# EAGLE design NEJE-KZ-board (EAGLE 9.6.2)
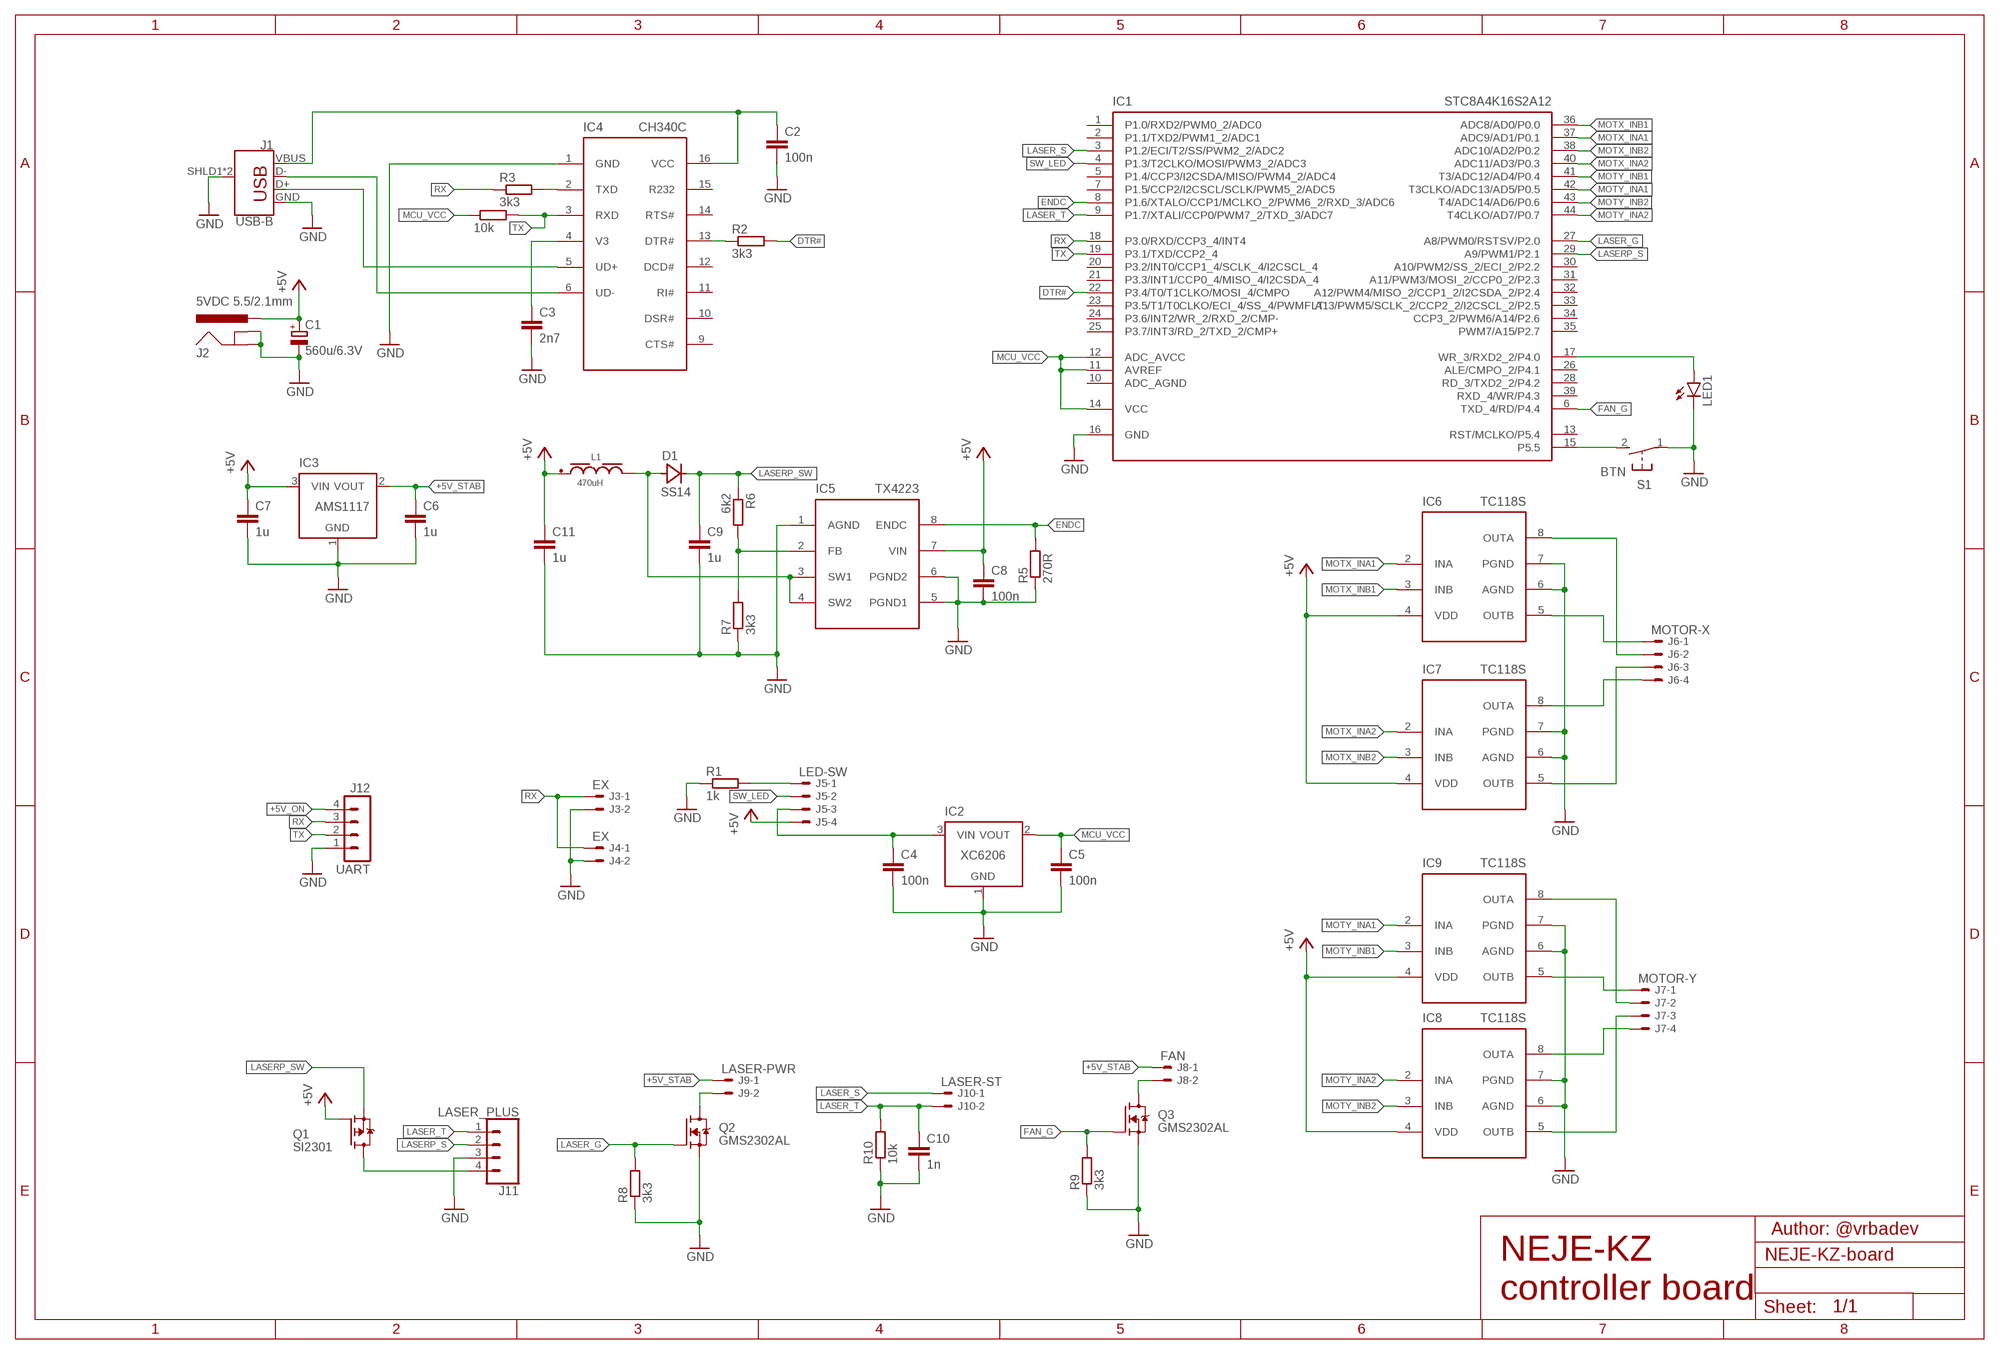
[diagram p0: schematic, sheet 1]

## Parts
C1  560u/6.3V  CPOL-EUE2.5-7  [E2,5-7]
C2  100n  C-EUC0402  [C0402]
C3  2n7  C-EUC0402  [C0402]
C4  100n  C-EUC0402  [C0402]
C5  100n  C-EUC0402  [C0402]
C6  1u  C-EUC0603  [C0603]
C7  1u  C-EUC0603  [C0603]
C8  100n  C-EUC0402  [C0402]
C9  1u  C-EUC0805  [C0805]
C10  1n  C-EUC0402  [C0402]
C11  1u  C-EUC0805  [C0805]
D1  SS14  MBRA340T3  [SMA]
IC1  STC8A4K16S2A12  [LQFP44-10X10]
IC2  XC6206  [SOT23-3]
IC3  AMS1117  [SOT223]
IC4  CH340C  [SO16]
IC5  TX4223  [SOIC8]
IC6  TC118S  [SOIC8]
IC7  TC118S  [SOIC8]
IC8  TC118S  [SOIC8]
IC9  TC118S  [SOIC8]
J1  USB-B  USB_B_PTH  [USB-B-PTH]
J2  5VDC 5.5/2.1mm  POWER_JACKSLT  [POWER_JACK_SLOT]
J3  EX  JST-XH-02-PIN-LONG-PAD  [JST-XH-02-PACKAGE-LONG-PAD]
J4  EX  JST-XH-02-PIN-LONG-PAD  [JST-XH-02-PACKAGE-LONG-PAD]
J5  LED-SW  JST-XH-04-PIN-LONG-PAD  [JST-XH-04-PACKAGE-LONG-PAD]
J6  MOTOR-X  JST-XH-04-PIN-LONG-PAD  [JST-XH-04-PACKAGE-LONG-PAD]
J7  MOTOR-Y  JST-XH-04-PIN-LONG-PAD  [JST-XH-04-PACKAGE-LONG-PAD]
J8  FAN  JST-XH-02-PIN-LONG-PAD  [JST-XH-02-PACKAGE-LONG-PAD]
J9  LASER-PWR  JST-XH-02-PIN-LONG-PAD  [JST-XH-02-PACKAGE-LONG-PAD]
J10  LASER-ST  JST-XH-02-PIN-LONG-PAD  [JST-XH-02-PACKAGE-LONG-PAD]
J11  LASER_PLUS  CONN_04SMD2  [1X04_1MM_RA]
J12  UART  MA04-1  [MA04-1]
L1  470uH  WE-PD_7345_74477724  [WE-PD_7345]
LED1  LEDCHIP-LED0805  [CHIP-LED0805]
Q1  SI2301  [SOT23-3]
Q2  GMS2302AL  [SOT23-3]
Q3  GMS2302AL  [SOT23-3]
R1  1k  R-EU_R0402  [R0402]
R2  3k3  R-EU_R0402  [R0402]
R3  3k3  R-EU_R0402  [R0402]
R4  10k  R-EU_R0402  [R0402]
R5  270R  R-EU_R0402  [R0402]
R6  6k2  R-EU_R0402  [R0402]
R7  3k3  R-EU_R0402  [R0402]
R8  3k3  R-EU_R0402  [R0402]
R9  3k3  R-EU_R0402  [R0402]
R10  10k  R-EU_R0402  [R0402]
S1  BTN  DTSM-3  [DTSM-3]

## Nets
+5V: C1.+ C7.1 C8.1 C11.1 IC3.3(VIN) IC5.7(VIN) IC6.4(VDD) IC7.4(VDD) IC8.4(VDD) IC9.4(VDD) J2.PWR J5.4 L1.1 Q1.1(G)
+5V_ON: C4.1 IC2.3(VIN) J5.3 J12.4
+5V_STAB: C6.1 IC3.2(VOUT) J8.1 J9.1
+5VUSB: C2.1 IC4.16(VCC) J1.VBUS
BTN: IC1.15(P5.5) S1.2
DTR#: IC1.22(P3.4/T0/T1CLKO/MOSI_4/CMPO) R2.2
ENDC: IC1.8(P1.6/XTALO/CCP1/MCLKO_2/PWM6_2/RXD_3/ADC6) IC5.8(ENDC) R5.2
FAN_G: IC1.6(TXD_4/RD/P4.4) Q3.1(G) R9.2
GND: C1.- C2.2 C3.2 C4.2 C5.2 C6.2 C7.2 C8.2 C9.2 C10.2 C11.2 IC1.16(GND) IC2.1(GND) IC3.1(GND) IC4.1(GND) IC5.1(AGND) IC5.5(PGND1) IC5.6(PGND2) IC6.6(AGND) IC6.7(PGND) IC7.6(AGND) IC7.7(PGND) IC8.6(AGND) IC8.7(PGND) IC9.6(AGND) IC9.7(PGND) J1.GND J1.SHLD1(SHIELD) J1.SHLD2(SHIELD) J2.GND@1(GNDBREAK) J2.GND@2(GND) J3.2 J4.2 J11.3 J12.1 LED1.C Q2.2(S) Q3.2(S) R1.1 R5.1 R7.1 R8.1 R9.1 R10.1 S1.1
LASER_G: IC1.27(A8/PWM0/RSTSV/P2.0) Q2.1(G) R8.2
LASER_S: IC1.3(P1.2/ECI/T2/SS/PWM2_2/ADC2) J10.1
LASER_T: C10.1 IC1.9(P1.7/XTALI/CCP0/PWM7_2/TXD_3/ADC7) J10.2 J11.1 R10.2
LASERP_S: IC1.29(A9/PWM1/P2.1) J11.2
LASERP_SW: C9.1 D1.C Q1.2(S) R6.1
LED1: IC1.17(WR_3/RXD2_2/P4.0) LED1.A
MCU_VCC: C5.1 IC1.11(AVREF) IC1.12(ADC_AVCC) IC1.14(VCC) IC2.2(VOUT) R4.1
MOTX_INA1: IC1.37(ADC9/AD1/P0.1) IC6.2(INA)
MOTX_INA2: IC1.40(ADC11/AD3/P0.3) IC7.2(INA)
MOTX_INB1: IC1.36(ADC8/AD0/P0.0) IC6.3(INB)
MOTX_INB2: IC1.38(ADC10/AD2/P0.2) IC7.3(INB)
MOTY_INA1: IC1.42(T3CLKO/ADC13/AD5/P0.5) IC9.2(INA)
MOTY_INA2: IC1.44(T4CLKO/AD7/P0.7) IC8.2(INA)
MOTY_INB1: IC1.41(T3/ADC12/AD4/P0.4) IC9.3(INB)
MOTY_INB2: IC1.43(T4/ADC14/AD6/P0.6) IC8.3(INB)
N$1: C3.1 IC4.4(V3)
N$2: IC4.13(DTR#) R2.1
N$3: IC4.2(TXD) R3.2
N$5: J5.1 R1.2
N$7: IC6.5(OUTB) J6.1
N$8: IC6.8(OUTA) J6.2
N$9: IC7.5(OUTB) J6.3
N$10: IC7.8(OUTA) J6.4
N$11: IC9.5(OUTB) J7.1
N$12: IC9.8(OUTA) J7.2
N$13: IC8.5(OUTB) J7.3
N$14: IC8.8(OUTA) J7.4
N$15: IC5.2(FB) R6.2 R7.2
N$16: J9.2 Q2.3(D)
N$18: J8.2 Q3.3(D)
N$19: J11.4 Q1.3(D)
N$20: D1.A IC5.3(SW1) IC5.4(SW2) L1.2
RX: IC1.18(P3.0/RXD/CCP3_4/INT4) J3.1 J4.1 J12.3 R3.1
SW_LED: IC1.4(P1.3/T2CLKO/MOSI/PWM3_2/ADC3) J5.2
TX: IC1.19(P3.1/TXD/CCP2_4) IC4.3(RXD) J12.2 R4.2
USB_D+: IC4.5(UD+) J1.D+
USB_D-: IC4.6(UD-) J1.D-
Unconnected: IC1.1(P1.0/RXD2/PWM0_2/ADC0) IC1.2(P1.1/TXD2/PWM1_2/ADC1) IC1.5(P1.4/CCP3/I2CSDA/MISO/PWM4_2/ADC4) IC1.7(P1.5/CCP2/I2CSCL/SCLK/PWM5_2/ADC5) IC1.10(ADC_AGND) IC1.13(RST/MCLKO/P5.4) IC1.20(P3.2/INT0/CCP1_4/SCLK_4/I2CSCL_4) IC1.21(P3.3/INT1/CCP0_4/MISO_4/I2CSDA_4) IC1.23(P3.5/T1/T0CLKO/ECI_4/SS_4/PWMFLT) IC1.24(P3.6/INT2/WR_2/RXD_2/CMP-) IC1.25(P3.7/INT3/RD_2/TXD_2/CMP+) IC1.26(ALE/CMPO_2/P4.1) IC1.28(RD_3/TXD2_2/P4.2) IC1.30(A10/PWM2/SS_2/ECI_2/P2.2) IC1.31(A11/PWM3/MOSI_2/CCP0_2/P2.3) IC1.32(A12/PWM4/MISO_2/CCP1_2/I2CSDA_2/P2.4) IC1.33(A13/PWM5/SCLK_2/CCP2_2/I2CSCL_2/P2.5) IC1.34(CCP3_2/PWM6/A14/P2.6) IC1.35(PWM7/A15/P2.7) IC1.39(RXD_4/WR/P4.3) IC4.9(CTS#) IC4.10(DSR#) IC4.11(RI#) IC4.12(DCD#) IC4.14(RTS#) IC4.15(R232)

## Notes on the sheet
- Author: @vrbadev
- NEJE-KZ
  controller board

## Library data of the parts
C1 = rcl:CPOL-EU: POLARIZED CAPACITOR, European symbol; SPICEPREFIX: C
C2-C11 = rcl:C-EU: CAPACITOR, European symbol; SPICEPREFIX: C
D1 = diode:MBRA340T3: Surface Mount Schottky Power Rectifier Source: http://www.onsemi.com/pub_link/Collateral/MBRA340T3-D.PDF
IC1 = custom-library:STC8A4K16S2A12: STC Micro - STC8F family of Micro-controllers
IC2 = custom-library:XC6206: Torex XC6206 Series The XC6206 series are highly precise, low power consumption, 3 terminal, positive voltage regulators manufactured using CMOS and laser trimming technologies. The series provides large currents with a significantly small dropout voltage. The XC6206 consists of a current limiter circuit, a driver transistor, a precision reference voltage and an error correction circuit. The series is compatible with low ESR ceramic capacitors. The currrent limiter's foldback circuit operates as a short circuit protection as well as the output current limiter for the output pin. Output voltages are internally by laser trimming technologies. It is selectable in 0.1V increments within a range of 1.2V to 5.0V. Marking: 662K
IC3 = custom-library:AMS1117: 1A LOW DROPOUT VOLTAGE REGULATOR
IC4 = custom-library:CH340C: CH340 is a USB bus conversion chip, it can realize USB to UART interface or USB to printer interface. In serial UART mode, CH340 provides common MODEM liaison signal, used to expand UART interface of computer or upgrade the common serial device to USB bus directly. For more information on USB conversion to printer interface please refer to the manual CH340DS2.
IC5 = custom-library:TX4223: High efficiency, 5A 1.2MHZ DC-DC boost chip
IC6-IC9 = custom-library:TC118S
J1 = SparkFun-Connectors:USB_B: USB Type B Connector SparkFun Products: SparkFun Stepoko <https://www.sparkfun.com/products/13899> PTH; PROD_ID: CONN-08278; SF_ID: PRT-00139
J2 = kanflo:POWER_JACK: Power Jack This is the standard 5.5mm barrel jack for power. The SLT footprint has been proven in designs produced by DirtyPCBs.com and only works if the mill layer is transmitted to the PCB fab house and the fab house accepts it. Rumours has it OSH Park accepts this design too. This symbol is meant for the cheap PCB mount connectors you find on eBay, retailing at less than 2EUR/10pcs (search for "dc power jack 5.5 2.1 pcb"). The difference between these and the ones sold by eg. SparkFun is the location of the pads relative to the plastic body.
J3 J4 J8-J10 = jst_xh_con:JST-XH-02-PIN: JST XH Connector 2 Pin Wire to board connector. Pitch: 2,54 mm, (0.100") Number of pins: 2 Created by Rembrandt Electronics www.rembrandtelectronics.com
J5-J7 = jst_xh_con:JST-XH-04-PIN: JST XH Connector 2 Pin Wire to board connector. Pitch: 2,54 mm, (0.100") Number of pins: 4 Created by Rembrandt Electronics www.rembrandtelectronics.com
J11 = SparkFun-Connectors:CONN_04: Multi connection point. Often used as Generic Header-pin footprint for 0.1 inch spaced/style header connections On any of the 0.1 inch spaced packages, you can populate with these: Break Away Headers - Straight <https://www.sparkfun.com/products/116> (PRT-00116) Break Away Male Headers - Right Angle <https://www.sparkfun.com/products/553> (PRT-00553) Female Headers <https://www.sparkfun.com/products/115> (PRT-00115) Break Away Headers - Machine Pin <https://www.sparkfun.com/products/117> (PRT-00117) Break Away Female Headers - Swiss Machine Pin <https://www.sparkfun.com/products/743> (PRT-00743) For SCREWTERMINALS and SPRING TERMINALS visit here: Screw Terimnals on SparkFun.com <https://www.sparkfun.com/search/results?term=Screw+Terminals> (5mm/3.5mm/2.54mm spacing) This device is also useful as a general connection point to wire up your design to another part of your project. Our various solder wires solder well into these plated through hole pads. Hook-Up Wire - Assortment (Stranded, 22 AWG) <https://www.sparkfun.com/products/11375> (PRT-11375) Hook-Up Wire - Assortment (Solid Core, 22 AWG) <https://www.sparkfun.com/products/11367> (PRT-11367) View the entire wire category on our website here <https://www.sparkfun.com/categories/141> Special notes: Molex polarized connector foot print use with SKU : PRT-08231 with associated crimp pins and housings. 1MM SMD Version SKU: PRT-10208; PROD_ID: CONN-10310; SF_ID: PRT-10208
J12 = con-lstb:MA04-1: PIN HEADER; OC_FARNELL: unknown; OC_NEWARK: unknown
L1 = Eagle_WE-PD (rev20a):WE-PD_7345: WE-PD SMT Power Inductor Characteristics AECQ 200 Qualified Ultra low RDC and RAC Highest possible saturation current based on Ferrite Suitable for switching frequency up to 10MHz Temperature dependent parameter available on Redexpert Operating Temperature from -40°C to +125°C / +150°C Types WE-PD: Since always with low loss material, tight tolerances and high saturation behavior compared to other manufacturers in the market WE-PD Robust: Plastic base improves the mechanical stability and efficiency WE-PD Performance: MnZn core improves Saturation and RDC for highest efficiency Applications Switch Mode Power supplies from 0,1W up to 300W Integrated DC DC Converter Ideal for Switch Mode Power supplies with extreme high efficiency (>95%) <https://www.we-online.com/catalog/media/o14825v209%20Family_WE-PD.jpg> Details see: https://www.we-online.com/catalog/en/WE-PD/ Updated by Yingchun,Shan 2019-07-25 2019 (C) Wurth Elektronik; DATASHEET-URL: https://www.we-online.com/catalog/datasheet/74477724.pdf; FRES: 3.2MHz; IR: 0.29A; ISAT: 0.34A; MOUNT: SMT; PART-NUMBER: 74477724; RDC-MAX: 3010mOhm; RDC-TYP: 1600mOhm; VERSION: Standard
LED1 = led:LED: LED OSRAM: - CHIPLED LG R971, LG N971, LY N971, LG Q971, LY Q971, LO R971, LY R971 LH N974, LH R974 LS Q976, LO Q976, LY Q976 LO Q996 - Hyper CHIPLED LW Q18S LB Q993, LB Q99A, LB R99A - SideLED LS A670, LO A670, LY A670, LG A670, LP A670 LB A673, LV A673, LT A673, LW A673 LH A674 LY A675 LS A676, LA A676, LO A676, LY A676, LW A676 LS A679, LY A679, LG A679 - Hyper Micro SIDELED® LS Y876, LA Y876, LO Y876, LY Y876 LT Y87S - SmartLED LW L88C, LW L88S LB L89C, LB L89S, LG L890 LS L89K, LO L89K, LY L89K LS L896, LA L896, LO L896, LY L896 - TOPLED LS T670, LO T670, LY T670, LG T670, LP T670 LSG T670, LSP T670, LSY T670, LOP T670, LYG T670 LG T671, LOG T671, LSG T671 LB T673, LV T673, LT T673, LW T673 LH T674 LS T676, LA T676, LO T676, LY T676, LB T676, LH T676, LSB T676, LW T676 LB T67C, LV T67C, LT T67C, LS T67K, LO T67K, LY T67K, LW E67C LS E67B, LA E67B, LO E67B, LY E67B, LB E67C, LV E67C, LT E67C LW T67C LS T679, LY T679, LG T679 LS T770, LO T770, LY T770, LG T770, LP T770 LB T773, LV T773, LT T773, LW T773 LH T774 LS E675, LA E675, LY E675, LS T675 LS T776, LA T776, LO T776, LY T776, LB T776 LHGB T686 LT T68C, LB T68C - Hyper Mini TOPLED® LB M676 - Mini TOPLED Santana® LG M470 LS M47K, LO M47K, LY M47K Source: http://www.osram.convergy.de LUXEON: - LUMILED® LXK2-PW12-R00, LXK2-PW12-S00, LXK2-PW14-U00, LXK2-PW14-V00 LXK2-PM12-R00, LXK2-PM12-S00, LXK2-PM14-U00 LXK2-PE12-Q00, LXK2-PE12-R00, LXK2-PE12-S00, LXK2-PE14-T00, LXK2-PE14-U00 LXK2-PB12-K00, LXK2-PB12-L00, LXK2-PB12-M00, LXK2-PB14-N00, LXK2-PB14-P00, LXK2-PB14-Q00 LXK2-PR12-L00, LXK2-PR12-M00, LXK2-PR14-Q00, LXK2-PR14-R00 LXK2-PD12-Q00, LXK2-PD12-R00, LXK2-PD12-S00 LXK2-PH12-R00, LXK2-PH12-S00 LXK2-PL12-P00, LXK2-PL12-Q00, LXK2-PL12-R00 Source: www.luxeon.com KINGBRIGHT: KA-3528ASYC Source: www.kingbright.com
Q1 = custom-library:SI2301: P-Channel 20-V(D-S) MOSFET Marking: A1sHB
Q2 Q3 = custom-library:GMS2302AL: N-Channel Enhancement-Mode MOS FETs Marking: A2sHB
R1-R10 = rcl:R-EU_: RESISTOR, European symbol; SPICEPREFIX: R
S1 = switch-tact:DTSM-3

## Board
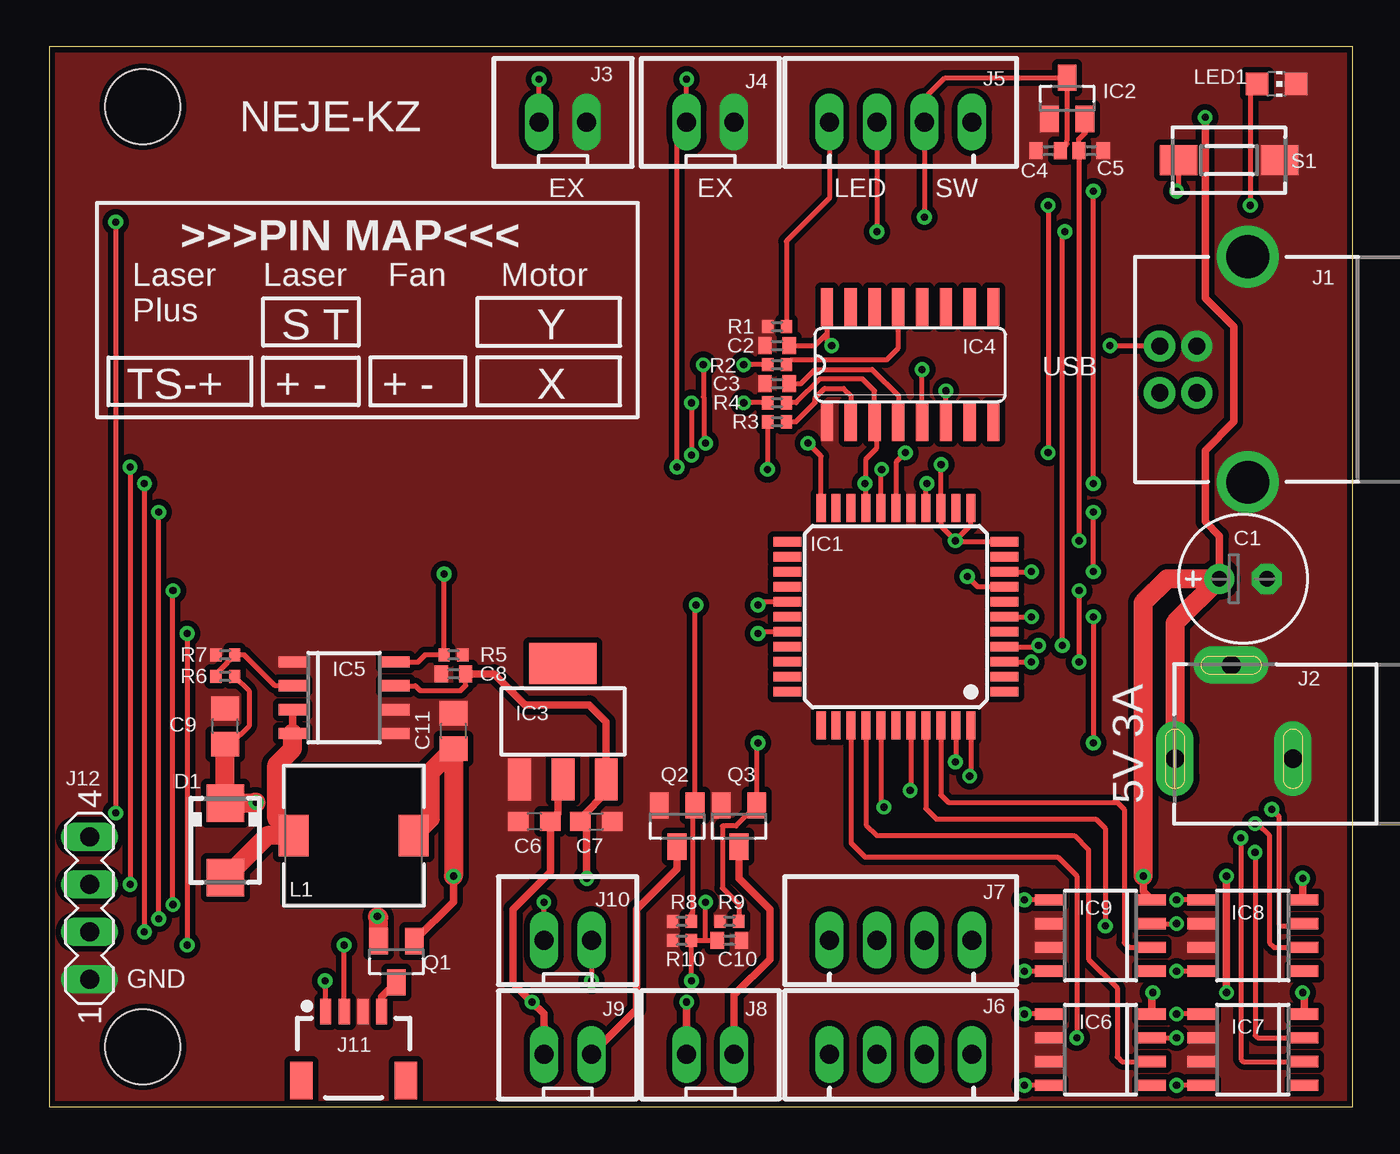
[diagram p1: board, top side]
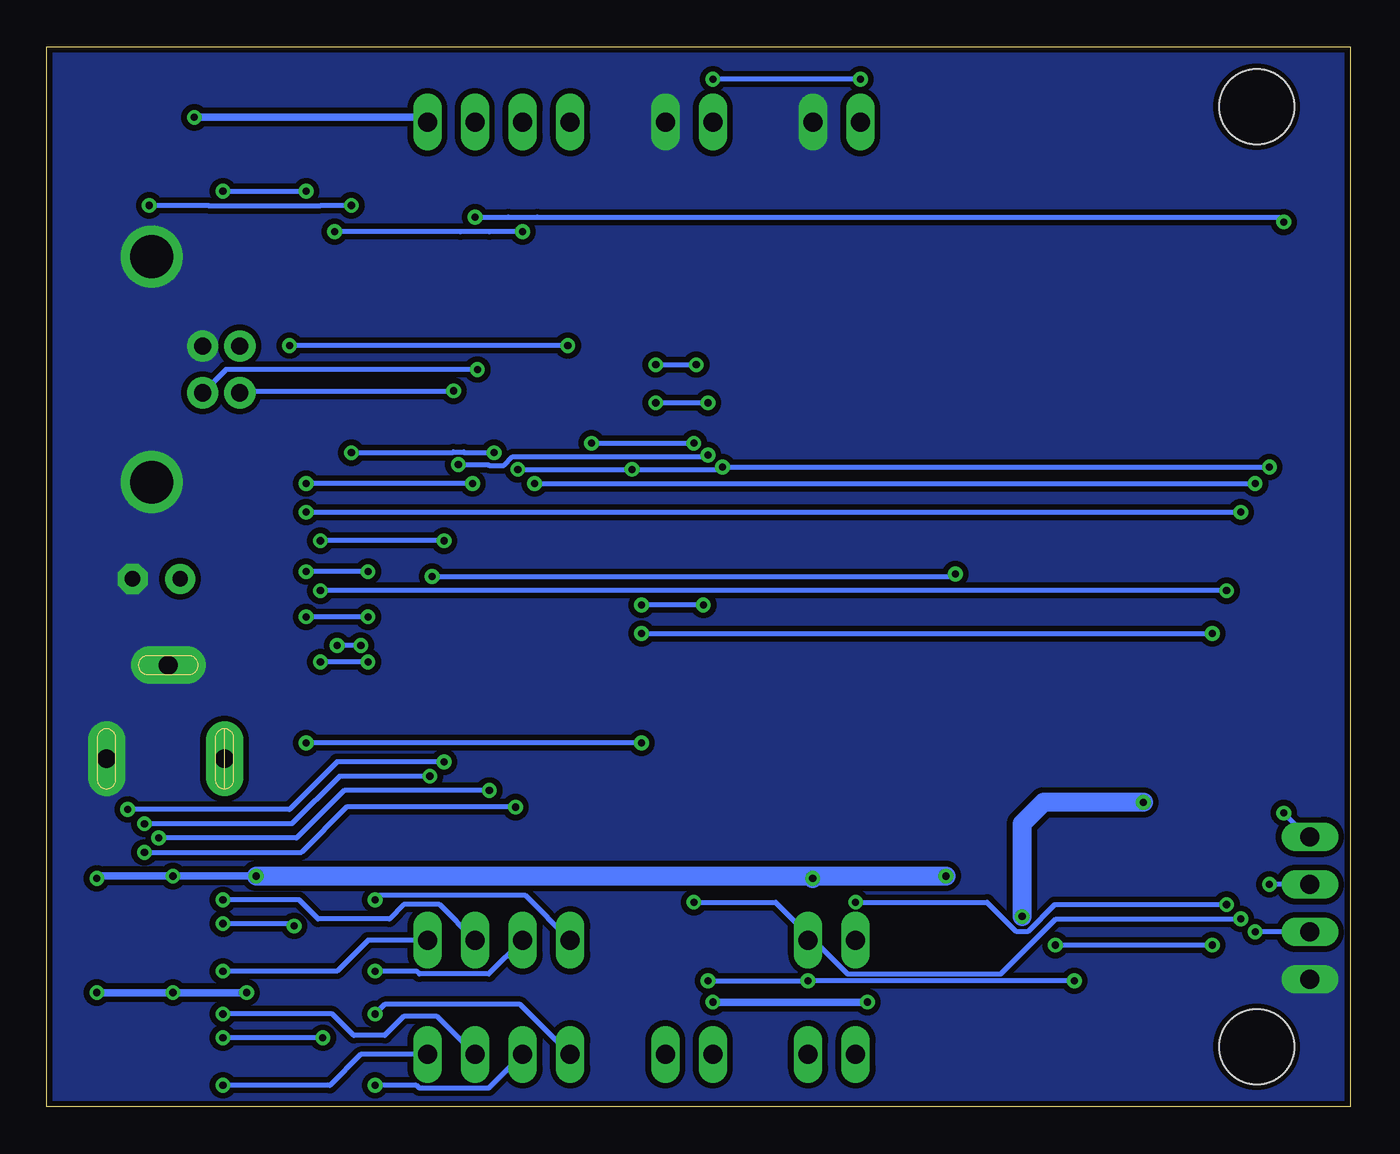
[diagram p2: board, bottom side, seen from below]

Size 69.6 x 56.6 mm. Coordinates in mm from the lower left corner, seen from the top.
Outline: 0,0 69.6,0 69.6,56.6 0,56.6 0,0
Copper layers (1*16): Top 0.035mm / dielectric 1.5mm / Bottom 0.035mm
Design rules "default *": minimum track width 6mil, minimum drill 0.35mm, track to track 6mil, track to pad 6mil, pad to pad 6mil, via to via 6mil, smd to smd 6mil, copper to edge 10mil, drill to drill 6mil, minimum pad ring 10mil, minimum via ring 8mil, stop-mask expansion 4mil, vias tented up to drill 0mil, thermal gap 10mil
Holes 4 mm at 5,3.2 5,53.4

### Footprints (pad centres in the part's own frame; a part is rotated, then mirrored left to right if it is on the bottom)
E2,5-7 = drill 0.813 pad 1.6: + -1.27,0 | drill 0.813 pad 1.6 octagon: - 1.27,0
C0402 = smd 0.7 x 0.9: 1 -0.65,0; 2 0.65,0
C0603 = smd 1.1 x 1: 1 -0.85,0; 2 0.85,0
C0805 = smd 1.3 x 1.5: 1 -0.95,0; 2 0.95,0
SMA = smd 2 x 2: A 2,0; C -2,0
LQFP44-10X10 = smd 1.5 x 0.5: 1 -5.8,4; 2 -5.8,3.2; 3 -5.8,2.4; 4 -5.8,1.6; 5 -5.8,0.8; 6 -5.8,0; 7 -5.8,-0.8; 8 -5.8,-1.6; 9 -5.8,-2.4; 10 -5.8,-3.2; 11 -5.8,-4; 23 5.8,-4; 24 5.8,-3.2; 25 5.8,-2.4; 26 5.8,-1.6; 27 5.8,-0.8; 28 5.8,0; 29 5.8,0.8; 30 5.8,1.6; 31 5.8,2.4; 32 5.8,3.2; 33 5.8,4 | smd 0.5 x 1.5: 12 -4,-5.8; 13 -3.2,-5.8; 14 -2.4,-5.8; 15 -1.6,-5.8; 16 -0.8,-5.8; 17 0,-5.8; 18 0.8,-5.8; 19 1.6,-5.8; 20 2.4,-5.8; 21 3.2,-5.8; 22 4,-5.8; 34 4,5.8; 35 3.2,5.8; 36 2.4,5.8; 37 1.6,5.8; 38 0.8,5.8; 39 0,5.8; 40 -0.8,5.8; 41 -1.6,5.8; 42 -2.4,5.8; 43 -3.2,5.8; 44 -4,5.8
SOT23-3 = smd 1 x 1.4: 1 -0.95,-1.1; 2 0.95,-1.1; 3 0,1.1
SOT223 = smd 1.219 x 2.235: 1 -2.311,-3.099; 2 0,-3.099; 3 2.311,-3.099 | smd 3.6 x 2.2: 4 0,3.099
SO16 = smd 0.66 x 2.032: 1 -4.445,-3.073; 2 -3.175,-3.073; 3 -1.905,-3.073; 4 -0.635,-3.073; 5 0.635,-3.073; 6 1.905,-3.073; 7 3.175,-3.073; 8 4.445,-3.073; 9 4.445,3.073; 10 3.175,3.073; 11 1.905,3.073; 12 0.635,3.073; 13 -0.635,3.073; 14 -1.905,3.073; 15 -3.175,3.073; 16 -4.445,3.073
SOIC8 = smd 0.6 x 1.5: 1 -1.905,-2.75; 2 -0.635,-2.75; 3 0.635,-2.75; 4 1.905,-2.75; 5 1.905,2.75; 6 0.635,2.75; 7 -0.635,2.75; 8 -1.905,2.75
USB-B-PTH = drill 0.914 pad 1.676: D+ 4,1.25; D- 5.981,1.25; GND 4,-1.25; VBUS 5.981,-1.25 | drill 2.286: SHLD1 1.282,-6.02; SHLD2 1.282,6.02
POWER_JACK_SLOT = drill 1 pad 2 long: GND@1 2.5,1.39; GND@2 -2.5,-1.91; PWR 2.5,-4.91
JST-XH-02-PACKAGE-LONG-PAD = drill 1.016 long: 1 -1.27,0; 2 1.27,0
JST-XH-04-PACKAGE-LONG-PAD = drill 1.016 long: 1 -3.81,0; 2 -1.27,0; 3 1.27,0; 4 3.81,0
1X04_1MM_RA = smd 0.6 x 1.35: 1 -1.5,0; 2 -0.5,0; 3 0.5,0; 4 1.5,0 | smd 1.2 x 2: NC1 2.8,-3.675; NC2 -2.8,-3.675
MA04-1 = drill 1.016 long: 1 -3.81,0; 2 -1.27,0; 3 1.27,0; 4 3.81,0
WE-PD_7345 = smd 1.6 x 2.2: 1 -3.2,0; 2 3.2,0
CHIP-LED0805 = smd 1.2 x 1.2: A 0,-1.05; C 0,1.05
R0402 = smd 0.6 x 0.7: 1 -0.5,0; 2 0.5,0
DTSM-3 = smd 2 x 1.6: 1 -2.7,0; 2 2.7,0

### Placement (x,y rotation side)
C1  63.75,28.19 0 top
C2  38.86,40.64 180 top
C3  38.86,38.61 180 top
C4  53.34,51.05 180 top
C5  55.63,51.05 0 top
C6  25.91,15.24 180 top
C7  29.21,15.24 0 top
C8  21.59,23.11 180 top
C9  9.4,20.32 90 top
C10  36.32,8.89 0 top
C11  21.59,20.07 90 top
D1  9.4,14.22 270 top
IC1  45.21,26.16 180 top
IC2  54.36,53.85 0 top
IC3  27.43,20.57 0 top
IC4  45.97,39.62 0 top
IC5  15.75,21.84 270 top
IC6  56.13,3.05 90 top
IC7  64.26,3.05 90 top
IC8  64.26,9.14 90 top
IC9  56.13,9.14 90 top
J1  65.28,39.37 180 top
J2  65.02,21.08 270 top
J3  27.43,52.58 0 top
J4  35.31,52.58 0 top
J5  45.47,52.58 0 top
J6  45.47,2.79 0 top
J7  45.47,8.89 0 top
J8  35.31,2.79 0 top
J9  27.69,2.79 0 top
J10  27.69,8.89 0 top
J11  16.26,5.08 0 top
J12  2.16,10.6 90 top
L1  16.26,14.48 180 top
LED1  65.53,54.61 270 top
Q1  18.54,7.75 180 top
Q2  33.53,14.99 180 top
Q3  36.83,14.99 180 top
R1  38.86,41.66 0 top
R2  38.86,39.62 180 top
R3  38.86,36.58 0 top
R4  38.86,37.59 0 top
R5  21.59,24.13 180 top
R6  9.4,22.99 180 top
R7  9.4,24.13 0 top
R8  33.78,9.91 0 top
R9  36.32,9.91 0 top
R10  33.78,8.89 0 top
S1  62.99,50.55 180 top

### Tracks (layer width: path | path; a pad name or v marks a point on that pad's centre or on a via)
+5V  (via drill 0.38)
  Top 0.254: Q1.1 19.28,8.64 | IC5.7 19.56,22.48 19.81,22.23 21.97,22.23 22.24,22.49 C8.1
  Top 0.406: C1.+ 62.48,30.48 61.72,31.24 61.72,35.05 63.25,36.58 63.25,41.66 61.72,43.18 v61.72,52.83 | C8.1 23.75,23.11 25.4,21.46 28.83,21.46 29.74,20.55 IC3.3 29.84,17.37 29.84,16.89 28.36,15.41 C7.1 28.7,14.9 v28.7,12.19 | IC9.4 58.42,11.51 v58.42,12.32 | IC8.4 66.93,11.13 v66.93,12.19 | IC7.4 67.01,6.01 v66.93,6.1 | IC6.4 58.88,6.05 v58.93,6.1 | v62.87,12.32 v62.87,6.1 | Q1.1 21.59,10.95 v21.59,12.32
  Top 1.016: J2.PWR 60.11,25.82 C1.+ 59.69,28.19 58.42,26.92 v58.42,12.32 | v21.59,12.32 C11.1 20.36,17.89 20.36,15.4 L1.1
  Bottom 0.406: v58.42,12.32 v62.87,12.32 66.8,12.32 v66.93,12.19 | v58.93,6.1 v62.87,6.1 v66.93,6.1 | J5.4 49.28,52.83 v61.72,52.83
  Bottom 1.016: v58.42,12.32 28.83,12.32 | v28.7,12.19 28.83,12.32 | 28.83,12.32 v21.59,12.32
+5V_ON  (via drill 0.38)
  Top 0.254: C4.1 54.35,51.41 54.35,51.62 54.36,51.63 IC2.3 47.84,54.95 46.74,53.85 J5.3 v46.74,47.5 | v3.56,47.24 v3.56,15.68
  Bottom 0.254: v46.74,47.5 44.97,47.5 44.97,47.51 43.42,47.51 43.42,47.5 3.81,47.5 v3.56,47.24 | J12.4 2.29,14.41 v3.56,15.68
+5V_STAB  (via drill 0.38)
  Top 0.406: J8.1 v34.04,5.59 | J9.1 26.42,4.95 v25.78,5.59 24.77,6.6 24.77,10.54 26.76,12.53 C6.1 27.18,15.66 27.18,17.22 IC3.2
  Bottom 0.406: v25.78,5.59 v34.04,5.59
+5VUSB  (via drill 0.38)
  Top 0.254: C2.1 40.89,40.64 41.53,41.27 | IC4.16 41.53,41.27 | J1.VBUS 56.66,40.62 v56.64,40.64 | 41.53,41.27 41.53,40.89 v41.78,40.64
  Bottom 0.254: v41.78,40.64 v56.64,40.64
BTN  (via drill 0.38)
  Top 0.254: IC1.15 46.81,33.22 v46.86,33.27 | S1.2 60.29,48.99 v60.2,48.9 | v55.75,33.27 v55.75,48.9
  Bottom 0.254: v60.2,48.9 v55.75,48.9 | v46.86,33.27 v55.75,33.27
DTR#  (via drill 0.38)
  Top 0.254: IC1.22 41.21,34.73 v40.51,35.43 | R2.2 v37.08,39.62 | v34.92,39.62 34.92,37.91 34.96,37.87 34.96,35.52 v35.05,35.43
  Bottom 0.254: v37.08,39.62 v34.92,39.62 | v40.51,35.43 v35.05,35.43
ENDC  (via drill 0.38)
  Top 0.254: IC1.8 49.58,27.76 v49.02,28.32 | IC5.8 19.68,23.75 20.07,24.13 R5.2 v21.09,28.44 v21.08,28.45
  Bottom 0.254: v49.02,28.32 21.21,28.32 v21.08,28.45
FAN_G  (via drill 0.38)
  Top 0.254: IC1.6 v52.45,26.16 | v37.85,19.43 37.78,19.36 Q3.1 36.68,14.99 35.94,14.99 35.94,11.68 36.83,10.79 R9.2 | v55.75,26.16 v55.75,19.43
  Bottom 0.254: v52.45,26.16 v55.75,26.16 | v37.85,19.43 v55.75,19.43
GND
  pour Bottom (isolate 0.305, no thermals): 0,56.6 69.6,56.6 69.6,0 0,0
  pour Top (isolate 0.305, no thermals): 0,56.6 69.6,56.6 69.6,0 0,0
LASER_G  (via drill 0.38)
  Top 0.254: IC1.27 38.01,26.96 v37.85,26.8 | v34.54,26.8 34.48,26.73 Q2.1 34.35,15.96 34.35,10.35 34.28,10.28 R8.2
  Bottom 0.254: v34.54,26.8 v37.85,26.8
LASER_S  (via drill 0.38)
  Top 0.254: IC1.3 52.44,23.76 v52.45,23.75 | J10.1 v26.42,10.92 | v6.6,10.79 v6.6,27.56 | v54.99,27.56 v54.99,23.75
  Bottom 0.254: v26.42,10.92 19.4,10.92 17.85,9.37 17.2,9.37 15.78,10.79 v6.6,10.79 | v6.6,27.56 v54.99,27.56 | v52.45,23.75 v54.99,23.75
LASER_T  (via drill 0.38)
  Top 0.254: IC1.9 52.44,28.56 v52.45,28.57 | 35.05,8.89 R10.2 v34.28,6.74 v34.29,6.73 | 35.05,8.89 C10.1 | 35.05,8.89 v35.05,10.92 | J11.1 14.76,6.33 14.73,6.35 v14.73,6.73 | J10.2 v28.96,6.73 | v5.84,10.03 v5.84,31.75 | v55.75,28.57 v55.75,31.75
  Bottom 0.254: v34.29,6.73 v28.96,6.73 v14.73,6.73 | v35.05,10.92 30.68,10.92 26.85,7.09 18.66,7.09 15.71,10.03 v5.84,10.03 | v52.45,28.57 v55.75,28.57 | v55.75,31.75 v5.84,31.75
LASERP_S  (via drill 0.38)
  Top 0.254: IC1.29 37.94,25.36 v37.85,25.27 | J11.2 15.75,5.09 v15.75,8.64 | v7.37,25.27 v7.37,8.64
  Bottom 0.254: v15.75,8.64 v7.37,8.64 | v37.85,25.27 v7.37,25.27
LASERP_SW  (via drill 0.38)
  Top 0.254: R6.1 10.67,22.22 10.67,20.32 9.72,19.37 C9.1
  Top 1.016: C9.1 D1.C 10.95,16.22 | 10.95,16.22 10.98,16.26 | Q1.2 17.59,10.09 v17.53,10.16 | v11.05,16.26 11.05,16.22 10.95,16.22
  Bottom 1.016: v11.05,16.26 16.38,16.26 17.53,15.11 v17.53,10.16
LED1  (via drill 0.38)
  Top 0.254: v45.72,34.92 45.21,34.42 IC1.17 | LED1.A 64.14,54.26 v64.14,48.13 | v53.34,48.13 v53.34,34.92
  Bottom 0.254: v64.14,48.13 60.97,48.13 60.97,48.12 54.98,48.12 54.98,48.13 v53.34,48.13 | v53.34,34.92 47.94,34.92 47.9,34.96 47.35,34.96 47.31,34.92 v45.72,34.92
MCU_VCC  (via drill 0.38)
  Top 0.254: IC2.2 55.37,52.68 55.37,52.07 54.98,51.67 C5.1 54.98,30.24 v54.99,30.23 54.93,30.16 | v48.39,30.23 47.61,31 IC1.14 47.61,34.28 v47.62,34.29 | v48.39,30.23 49.21,31.05 IC1.12 | IC1.11 48.45,30.16 v48.39,30.23 | R4.1 v37.08,37.59 | v34.29,37.59 v34.29,34.8
  Bottom 0.254: v48.39,30.23 v54.99,30.23 | v37.08,37.59 v34.29,37.59 | v47.62,34.29 46.04,34.29 46,34.25 45.19,34.25 44.73,34.71 34.38,34.71 v34.29,34.8
MOTX_INA1
  Top 0.254: IC1.37 43.61,15.06 44.2,14.48 54.74,14.48 55.5,13.72 55.5,7.87 57.02,6.35 57.02,2.67 57.28,2.41 IC6.2
MOTX_INA2  (via drill 0.38)
  Top 0.254: IC1.40 46.01,16.93 v45.97,16.89 | v63.63,14.35 63.63,2.54 63.75,2.41 IC7.2
  Bottom 0.254: v45.97,16.89 53.72,16.89 56.26,14.35 v63.63,14.35
MOTX_INB1  (via drill 0.38)
  Top 0.254: IC1.36 42.81,14.08 43.56,13.34 53.85,13.34 54.86,12.32 v54.86,3.68 | IC6.3 v60.2,3.68
  Bottom 0.254: v54.86,3.68 v60.2,3.68
MOTX_INB2  (via drill 0.38)
  Top 0.254: IC1.38 44.41,16.17 v44.58,16 | v64.39,13.59 64.39,3.81 64.52,3.68 IC7.3
  Bottom 0.254: v44.58,16 53.59,16 56.01,13.59 v64.39,13.59
MOTY_INA1
  Top 0.254: IC1.42 47.61,16.65 48.01,16.26 57.02,16.26 57.4,15.88 57.4,8.76 57.66,8.51 IC9.2
MOTY_INA2  (via drill 0.38)
  Top 0.254: IC1.44 49.21,17.72 v49.15,17.65 | v64.39,15.11 64.52,15.11 65.15,14.48 65.15,8.76 65.41,8.51 IC8.2
  Bottom 0.254: v49.15,17.65 53.98,17.65 56.52,15.11 v64.39,15.11
MOTY_INB1  (via drill 0.38)
  Top 0.254: IC1.41 46.81,15.93 47.37,15.37 55.88,15.37 56.39,14.86 v56.39,9.65 | IC9.3 v60.2,9.78
  Bottom 0.254: v56.39,9.65 56.52,9.78 v60.2,9.78
MOTY_INB2  (via drill 0.38)
  Top 0.254: IC1.43 48.41,18.44 v48.39,18.41 | v65.28,15.88 65.66,15.49 65.66,9.78 65.79,9.65 66.89,9.65 IC8.3
  Bottom 0.254: v48.39,18.41 54.1,18.41 56.64,15.88 v65.28,15.88
N$1
  Top 0.254: C3.1 40.13,38.61 40.89,39.37 43.94,39.37 45.34,37.97 IC4.4
N$2
  Top 0.254: R2.1 39.62,39.88 44.7,39.88 45.34,40.51 IC4.13
N$3
  Top 0.254: R3.2 39.88,36.58 40.89,37.59 40.89,37.85 41.4,38.35 42.42,38.35 42.8,37.97 IC4.2
N$5
  Top 0.254: J5.1 41.66,48.51 39.36,46.22 R1.2
N$7  (via drill 0.38)
  Top 0.254: IC6.5 v52.07,4.95
  Bottom 0.254: J6.1 44.32,5.46 51.56,5.46 v52.07,4.95
N$8  (via drill 0.38)
  Top 0.254: IC6.8 v52.07,1.14
  Bottom 0.254: v52.07,1.14 49.86,1.14 49.71,0.99 46,0.99 J6.2
N$9  (via drill 0.38)
  Top 0.254: IC7.5 v60.2,4.95
  Bottom 0.254: J6.3 48.77,4.83 50.55,4.83 51.56,3.81 53.21,3.81 54.36,4.95 v60.2,4.95
N$10  (via drill 0.38)
  Top 0.254: IC7.8 v60.2,1.14
  Bottom 0.254: J6.4 52.83,2.79 54.48,1.14 v60.2,1.14
N$11  (via drill 0.38)
  Top 0.254: IC9.5 v52.07,11.05
  Bottom 0.254: v52.07,11.05 51.82,11.3 44.07,11.3 J7.1
N$12  (via drill 0.38)
  Top 0.254: IC9.8 v52.07,7.24
  Bottom 0.254: v52.07,7.24 49.86,7.24 49.71,7.09 46,7.09 J7.2
N$13  (via drill 0.38)
  Top 0.254: IC8.5 v60.2,11.05
  Bottom 0.254: J7.3 48.64,10.79 50.55,10.79 51.31,10.03 55.12,10.03 56.13,11.05 v60.2,11.05
N$14  (via drill 0.38)
  Top 0.254: IC8.8 v60.2,7.24
  Bottom 0.254: J7.4 52.45,8.89 54.1,7.24 v60.2,7.24
N$15
  Top 0.254: IC5.2 12.06,22.48 10.41,24.13 R7.2 9.48,23.71 9.48,23.66 8.9,23.09 R6.2
N$16
  Top 0.406: Q2.3 33.53,12.7 31.37,10.54 31.37,5.21 J9.2
N$18
  Top 0.406: Q3.3 36.83,12.19 38.48,10.54 38.48,7.87 36.58,5.97 J8.2
N$19
  Top 0.406: Q1.3 17.76,5.86 J11.4
N$20
  Top 0.406: IC5.3 IC5.4
  Top 1.016: D1.A 11.65,14.48 L1.2 12.15,15.4 12.15,18.26 13,19.11 IC5.4
RX  (via drill 0.38)
  Top 0.254: IC1.18 44.41,34 v44.45,34.04 | J3.1 v26.16,54.86 | v34.04,54.86 J4.1 33.53,52.07 v33.53,34.16 | R3.1 38.36,34.04 v38.35,34.04 | v4.32,34.16 v4.32,11.87 4.19,11.75
  Bottom 0.254: v44.45,34.04 v38.35,34.04 33.66,34.04 v33.53,34.16 v4.32,34.16 | J12.3 v4.32,11.87 | v26.16,54.86 v34.04,54.86
SW_LED  (via drill 0.38)
  Top 0.254: J5.2 v44.2,46.74 | IC1.4 52.96,24.56 52.96,24.64 v52.83,24.64 | v54.1,24.64 54.1,46.61 v54.23,46.74
  Bottom 0.254: v44.2,46.74 45.96,46.74 45.96,46.72 47.51,46.72 47.51,46.74 v54.23,46.74 | v52.83,24.64 v54.1,24.64
TX  (via drill 0.38)
  Top 0.254: R4.2 39.88,37.59 41.15,38.86 43.43,38.86 44.07,38.23 IC4.3 44.2,36.42 44.2,35.18 43.61,34.59 43.61,33.27 | IC1.19 43.61,33.27 | 43.61,33.27 v43.56,33.27 | v5.08,33.27 v5.08,9.34
  Bottom 0.254: v43.56,33.27 v5.08,33.27 | J12.2 v5.08,9.34
USB_D+  (via drill 0.38)
  Top 0.254: IC4.5 v46.61,39.37
  Bottom 0.254: v46.61,39.37 60.03,39.37 J1.D+
USB_D-  (via drill 0.38)
  Top 0.254: IC4.6 v47.88,38.23
  Bottom 0.254: J1.D- 59.19,38.23 v47.88,38.23

### Text on the board
tPlace: NEJE-KZ | EX | EX | LED | SW | >>>PIN MAP<<< | Laser | Fan | Motor | Laser / Plus | S T | Y | USB | TS-+ | + - | + - | X | 5V 3A | GND
200bmp: F:/Dropbox/BASTLENI/NEJE KZ laser driver/dps-laser-top_100dpi_bw.bmp